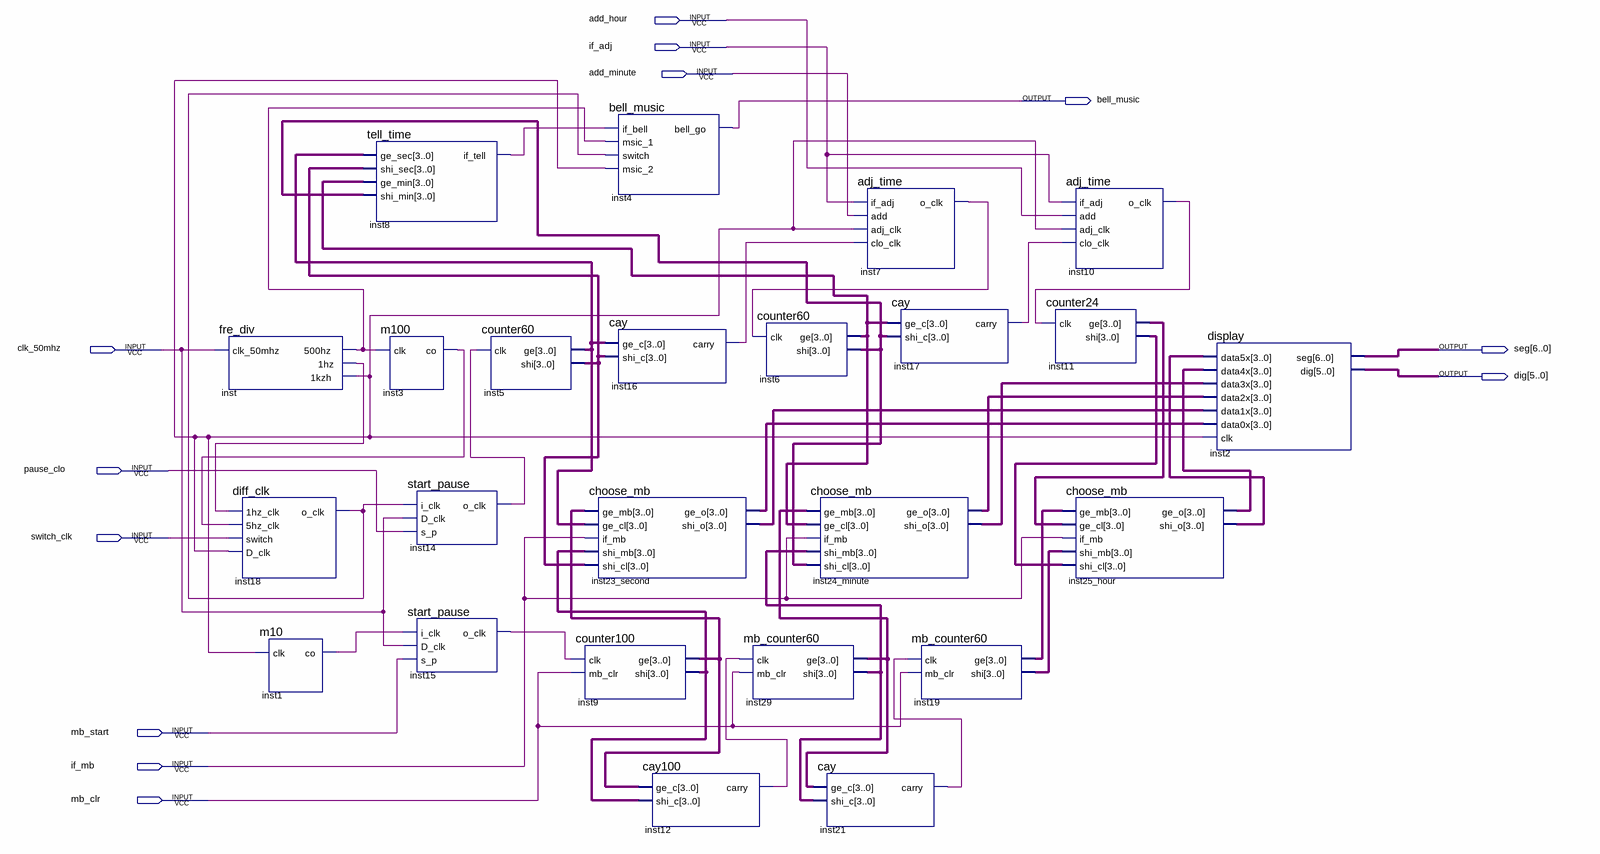
[diagram p0: schematic sheet]
// Quartus schematic common_clock.bdf as structural Verilog: 24 symbols, 12 pins
module common_clock (
  input  add_hour,
  input  if_adj,
  input  add_minute,
  input  clk_50mhz,
  input  pause_clo,
  input  switch_clk,
  input  mb_start,
  input  if_mb,
  input  mb_clr,
  output bell_music,
  output [6:0] seg,
  output [5:0] dig
);

  wire inst1_co, inst3_co, inst7_o_clk, inst8_if_tell, inst10_o_clk, inst12_carry, inst14_o_clk,
       inst15_o_clk, inst16_carry, inst17_carry, inst18_o_clk, inst21_carry, inst_1hz, inst_1kzh, inst_500hz;
  wire [3:0] inst5_ge, inst5_shi, inst6_ge, inst6_shi, inst9_ge, inst9_shi, inst11_ge, inst11_shi, inst19_ge,
       inst19_shi, inst23_second_ge_o, inst23_second_shi_o, inst24_minute_ge_o, inst24_minute_shi_o,
       inst25_hour_ge_o, inst25_hour_shi_o, inst29_ge, inst29_shi;

  fre_div inst (.clk_50mhz(clk_50mhz), .\500hz (inst_500hz), .\1hz (inst_1hz), .\1kzh (inst_1kzh));
  diff_clk inst18 (
    .\1hz_clk (inst_1hz), .\5hz_clk (inst3_co), .switch(switch_clk), .D_clk(inst_1kzh), .o_clk(inst18_o_clk));
  m10 inst1 (.clk(inst_1kzh), .co(inst1_co));
  tell_time inst8 (
    .ge_sec(inst5_ge), .shi_sec(inst5_shi), .ge_min(inst6_ge), .shi_min(inst6_shi), .if_tell(inst8_if_tell));
  m100 inst3 (.clk(inst_500hz), .co(inst3_co));
  start_pause inst14 (.i_clk(inst18_o_clk), .D_clk(clk_50mhz), .s_p(pause_clo), .o_clk(inst14_o_clk));
  start_pause inst15 (.i_clk(inst1_co), .D_clk(clk_50mhz), .s_p(mb_start), .o_clk(inst15_o_clk));
  counter60 inst5 (.clk(inst14_o_clk), .ge(inst5_ge), .shi(inst5_shi));
  bell_music inst4 (
    .if_bell(inst8_if_tell), .msic_1(inst_500hz), .switch(inst18_o_clk), .msic_2(inst_1kzh),
    .bell_go(bell_music));
  cay inst16 (.ge_c(inst5_ge), .shi_c(inst5_shi), .carry(inst16_carry));
  choose_mb inst23_second (
    .ge_mb(inst9_ge), .ge_cl(inst5_ge), .if_mb(if_mb), .shi_mb(inst9_shi), .shi_cl(inst5_shi),
    .ge_o(inst23_second_ge_o), .shi_o(inst23_second_shi_o));
  counter100 inst9 (.clk(inst15_o_clk), .mb_clr(mb_clr), .ge(inst9_ge), .shi(inst9_shi));
  cay100 inst12 (.ge_c(inst9_ge), .shi_c(inst9_shi), .carry(inst12_carry));
  counter60 inst6 (.clk(inst7_o_clk), .ge(inst6_ge), .shi(inst6_shi));
  mb_counter60 inst29 (.clk(inst12_carry), .mb_clr(mb_clr), .ge(inst29_ge), .shi(inst29_shi));
  choose_mb inst24_minute (
    .ge_mb(inst29_ge), .ge_cl(inst6_ge), .if_mb(if_mb), .shi_mb(inst29_shi), .shi_cl(inst6_shi),
    .ge_o(inst24_minute_ge_o), .shi_o(inst24_minute_shi_o));
  cay inst21 (.ge_c(inst29_ge), .shi_c(inst29_shi), .carry(inst21_carry));
  adj_time inst7 (.if_adj(if_adj), .add(add_minute), .adj_clk(inst_1kzh), .clo_clk(inst16_carry), .o_clk(inst7_o_clk));
  cay inst17 (.ge_c(inst6_ge), .shi_c(inst6_shi), .carry(inst17_carry));
  mb_counter60 inst19 (.clk(inst21_carry), .mb_clr(mb_clr), .ge(inst19_ge), .shi(inst19_shi));
  adj_time inst10 (.if_adj(if_adj), .add(add_hour), .adj_clk(inst_1kzh), .clo_clk(inst17_carry), .o_clk(inst10_o_clk));
  counter24 inst11 (.clk(inst10_o_clk), .ge(inst11_ge), .shi(inst11_shi));
  choose_mb inst25_hour (
    .ge_mb(inst19_ge), .ge_cl(inst11_ge), .if_mb(if_mb), .shi_mb(inst19_shi), .shi_cl(inst11_shi),
    .ge_o(inst25_hour_ge_o), .shi_o(inst25_hour_shi_o));
  display inst2 (
    .data5x(inst25_hour_shi_o), .data4x(inst25_hour_ge_o), .data3x(inst24_minute_shi_o),
    .data2x(inst24_minute_ge_o), .data1x(inst23_second_shi_o), .data0x(inst23_second_ge_o), .clk(inst_1kzh),
    .seg(seg), .dig(dig));
endmodule
